# EAGLE schematic audio (EAGLE 8.3.1)
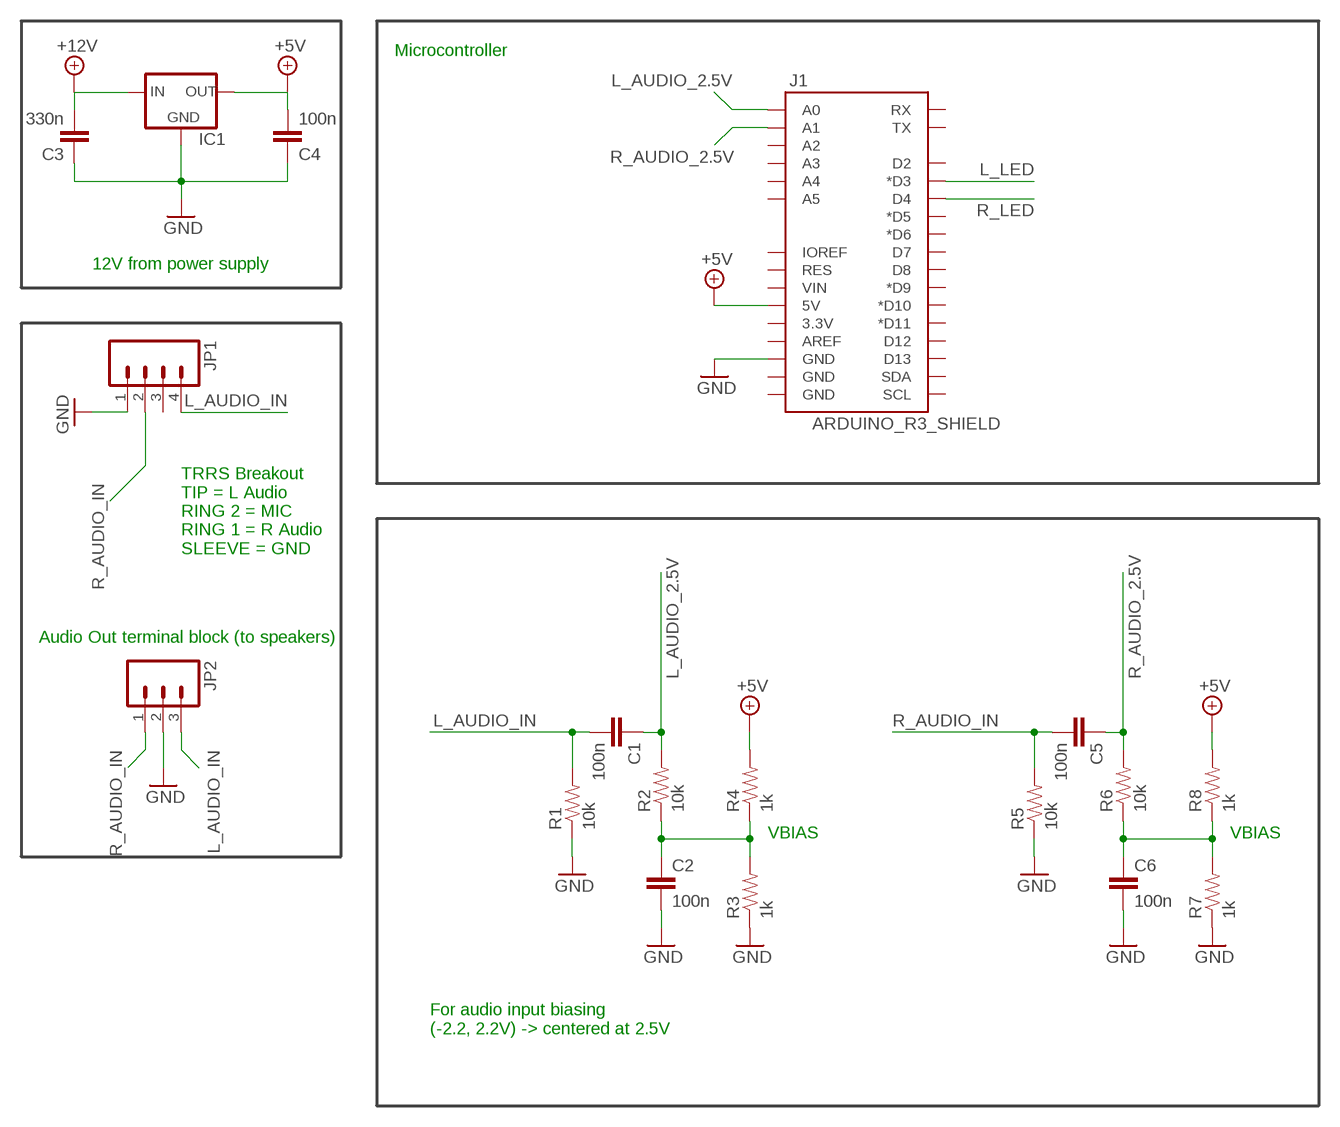
[diagram p0: schematic, sheet 1]

## Parts
C1  100n  CAP_  [AXIAL-5MM]
C2  100n  CAP_  [AXIAL-5MM]
C3  330n  CAP_  [AXIAL-5MM]
C4  100n  CAP_  [AXIAL-5MM]
C5  100n  CAP_  [AXIAL-5MM]
C6  100n  CAP_  [AXIAL-5MM]
IC1  5VREG_L7805SPACED  [TO-220-SPACED]
J1  ARDUINO_R3_SHIELD  [UNO_R3_SHIELD]
JP1  M04  [1X04]
JP2  M03  [1X03]
R1  10k  RESISTORPTH-1/4W  [AXIAL-0.4]
R2  10k  RESISTORPTH-1/4W  [AXIAL-0.4]
R3  1k  RESISTORPTH-1/4W  [AXIAL-0.4]
R4  1k  RESISTORPTH-1/4W  [AXIAL-0.4]
R5  10k  RESISTORPTH-1/4W  [AXIAL-0.4]
R6  10k  RESISTORPTH-1/4W  [AXIAL-0.4]
R7  1k  RESISTORPTH-1/4W  [AXIAL-0.4]
R8  1k  RESISTORPTH-1/4W  [AXIAL-0.4]

## Nets
+5V: C4.P$2 IC1.3(OUT) J1.5V R4.P$2 R8.P$2
+12V: C3.P$2 IC1.1(IN)
GND: C2.P$2 C3.P$1 C4.P$1 C6.P$2 IC1.2(GND) J1.GND@2(GND) JP1.1 JP2.2 R1.P$1 R3.P$1 R5.P$1 R7.P$1
L_AUDIO_2.5V: C1.P$1 J1.A0 R2.P$2
L_AUDIO_IN: C1.P$2 JP1.4 JP2.3 R1.P$2
L_LED: J1.D3(*D3)
N$1: C2.P$1 R2.P$1 R3.P$2 R4.P$1
N$2: C6.P$1 R6.P$1 R7.P$2 R8.P$1
R_AUDIO_2.5V: C5.P$1 J1.A1 R6.P$2
R_AUDIO_IN: C5.P$2 JP1.2 JP2.1 R5.P$2
R_LED: J1.D4
Unconnected: J1.3.3V J1.A2 J1.A3 J1.A4 J1.A5 J1.AREF J1.D2 J1.D5(*D5) J1.D6(*D6) J1.D7 J1.D8 J1.D9(*D9) J1.D10(*D10) J1.D11(*D11) J1.D12 J1.D13 J1.GND@0(GND) J1.GND@1(GND) J1.IOREF J1.RES J1.RX J1.SCL J1.SDA J1.TX J1.VIN JP1.3

## Notes on the sheet
- Microcontroller
- 12V from power supply
- TRRS Breakout
  TIP = L Audio
  RING 2 = MIC
  RING 1 = R Audio
  SLEEVE = GND
- Audio Out terminal block (to speakers)
- VBIAS | VBIAS
- For audio input biasing
  (-2.2, 2.2V) -> centered at 2.5V

## Library data of the parts
C1-C6 = Devices:CAP: Capacitor Standard 0603 ceramic capacitor, and 0.1" leaded capacitor.
IC1 = Devices:5VREG_L7805: Voltage Regulator Switching 5v regulator Datasheet <http://power.murata.com/data/power/oki-78sr.pdf> Standard 7805 5V regulator. IGO (Input Ground Output). Spark Fun Electronics SKU : COM-00107 Datasheet <http://www.mouser.com/ds/2/308/MC7800-D-94905.pdf>
J1 = Devices:ARDUINO_R3_SHIELD: Shield form compatible with the Arduino Uno R3. Source: Sparkfun <https://github.com/sparkfun/SparkFun-Eagle-Libraries>
JP1 = Devices:M04: Standard 4-pin 0.1" header. NOTES ON THE VARIANTS LOCK and LOCK_LONGPADS... This footprint was designed to help hold the alignment of a through-hole component (i.e. 6-pin header) while soldering it into place. You may notice that each hole has been shifted either up or down by 0.005 of an inch from it's more standard position (which is a perfectly straight line). This slight alteration caused the pins (the squares in the middle) to touch the edges of the holes. Because they are alternating, it causes a "brace" to hold the component in place. 0.005 has proven to be the perfect amount of "off-center" position when using our standard breakaway headers. Although looks a little odd when you look at the bare footprint, once you have a header in there, the alteration is very hard to notice. Also,if you push a header all the way into place, it is covered up entirely on the bottom side. This idea of altering the position of holes to aid alignment will be further integrated into the Sparkfun Library for other footprints. It can help hold any component with 3 or more connection pins. Note: The Sparkfun version includes many other packages including surface mount that may be of future interest. Source: Sparkfun <https://github.com/sparkfun/SparkFun-Eagle-Libraries>
JP2 = Devices:M03: Standard 3-pin 0.1" header.
R1-R8 = Devices:RESISTOR: Resistor Basic schematic elements and footprints for 0603, 1206, and PTH resistors.